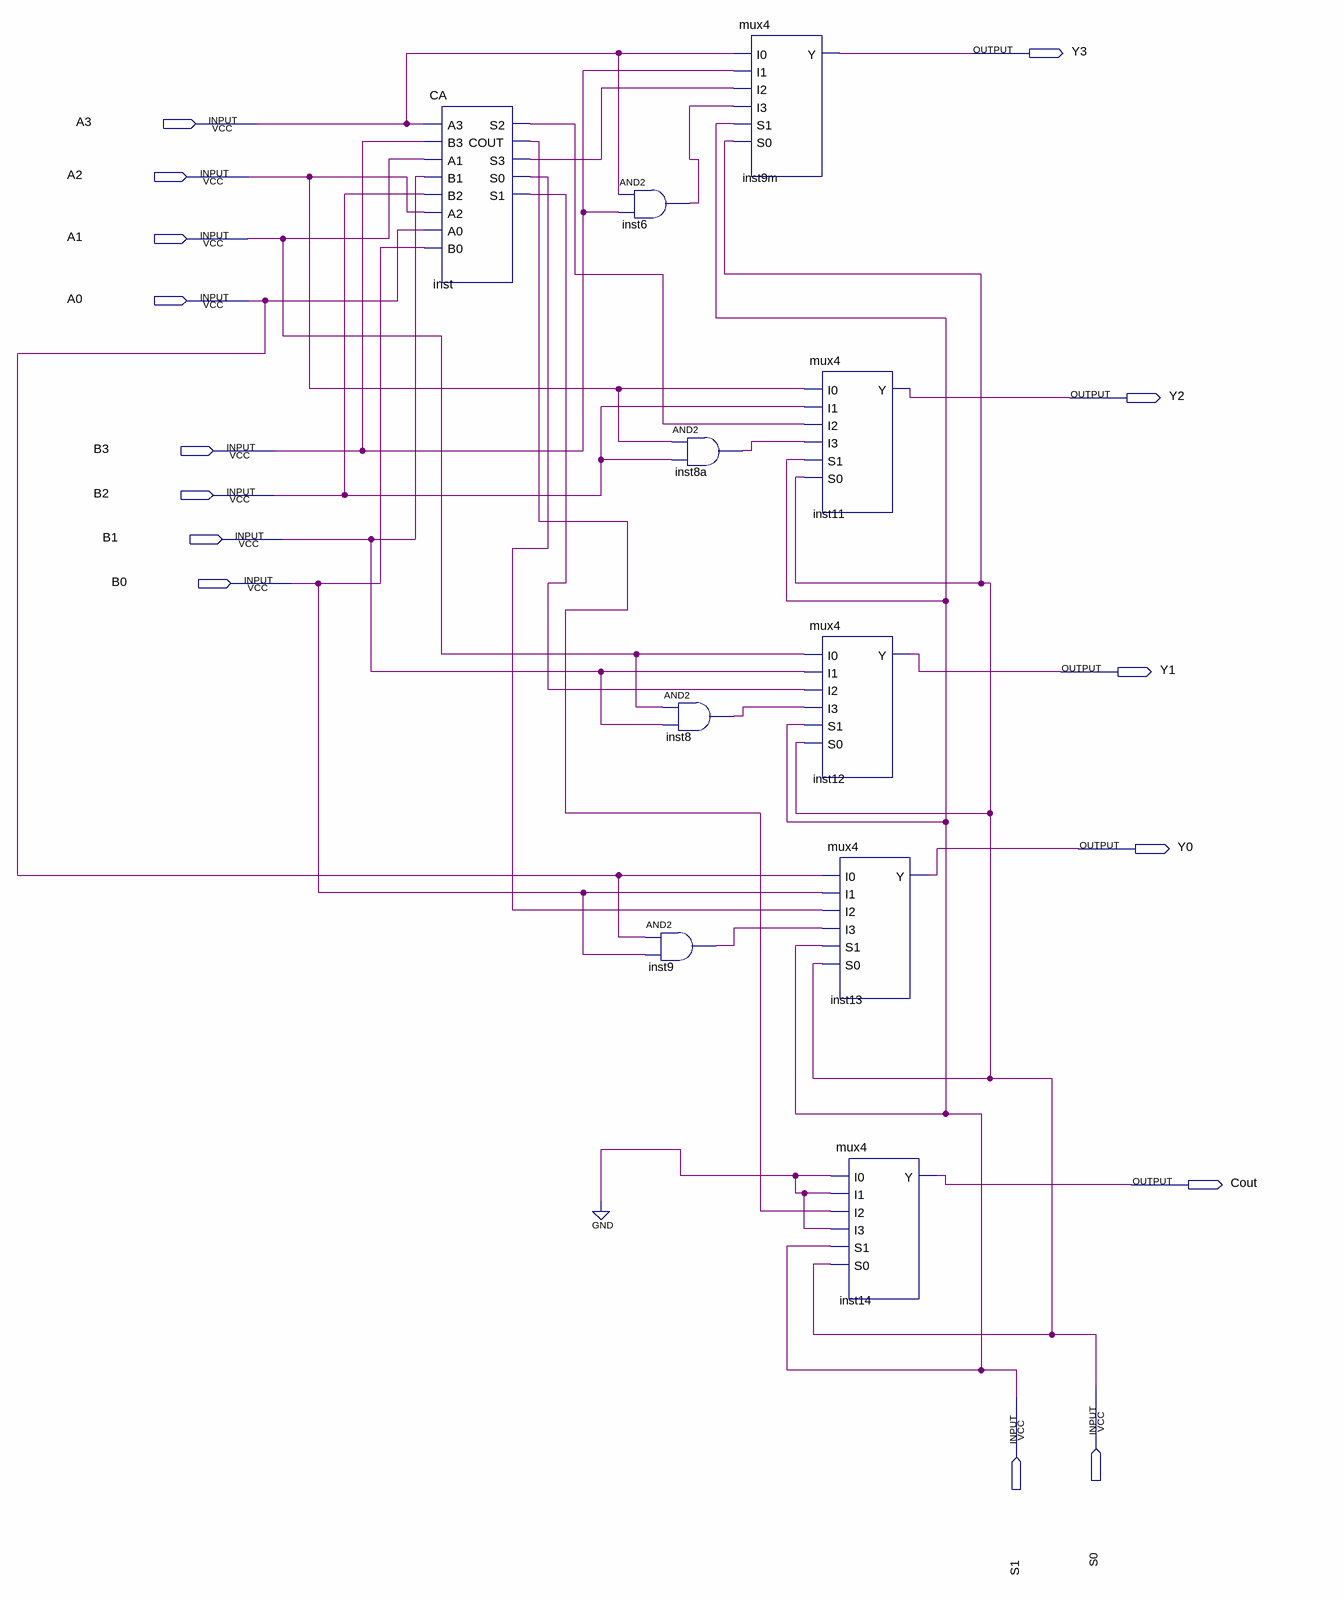
[diagram p0: schematic sheet]
// Quartus schematic ALU.bdf as structural Verilog: 10 symbols, 15 pins
module ALU (
  input  A3,
  input  A2,
  input  A1,
  input  A0,
  input  B3,
  input  B2,
  input  B1,
  input  B0,
  input  S0,
  input  S1,
  output Y3,
  output Y2,
  output Y1,
  output Y0,
  output Cout
);

  wire inst6_out, inst8_out, inst8a_out, inst9_out, inst_cout, inst_s0, inst_s1, inst_s2, inst_s3;

  CA inst (
    .A3(A3), .B3(B3), .A1(A1), .B1(B1), .B2(B2), .A2(A2), .A0(A0), .B0(B0), .S2(inst_s2), .COUT(inst_cout),
    .S3(inst_s3), .S0(inst_s0), .S1(inst_s1));
  and inst6 (inst6_out, A3, B3);
  and inst8 (inst8_out, A1, B1);
  and inst9 (inst9_out, A0, B0);
  mux4 inst9m (.I0(A3), .I1(B3), .I2(inst_s3), .I3(inst6_out), .S1(S1), .S0(S0), .Y(Y3));
  and inst8a (inst8a_out, A2, B2);
  mux4 inst11 (.I0(A2), .I1(B2), .I2(inst_s2), .I3(inst8a_out), .S1(S1), .S0(S0), .Y(Y2));
  mux4 inst12 (.I0(A1), .I1(B1), .I2(inst_s1), .I3(inst8_out), .S1(S1), .S0(S0), .Y(Y1));
  mux4 inst13 (.I0(A0), .I1(B0), .I2(inst_s0), .I3(inst9_out), .S1(S1), .S0(S0), .Y(Y0));
  mux4 inst14 (.I0(1'b0), .I1(1'b0), .I2(inst_cout), .I3(1'b0), .S1(S1), .S0(S0), .Y(Cout));
endmodule
